# EAGLE schematic GnZC - POC (EAGLE 9.6.2)
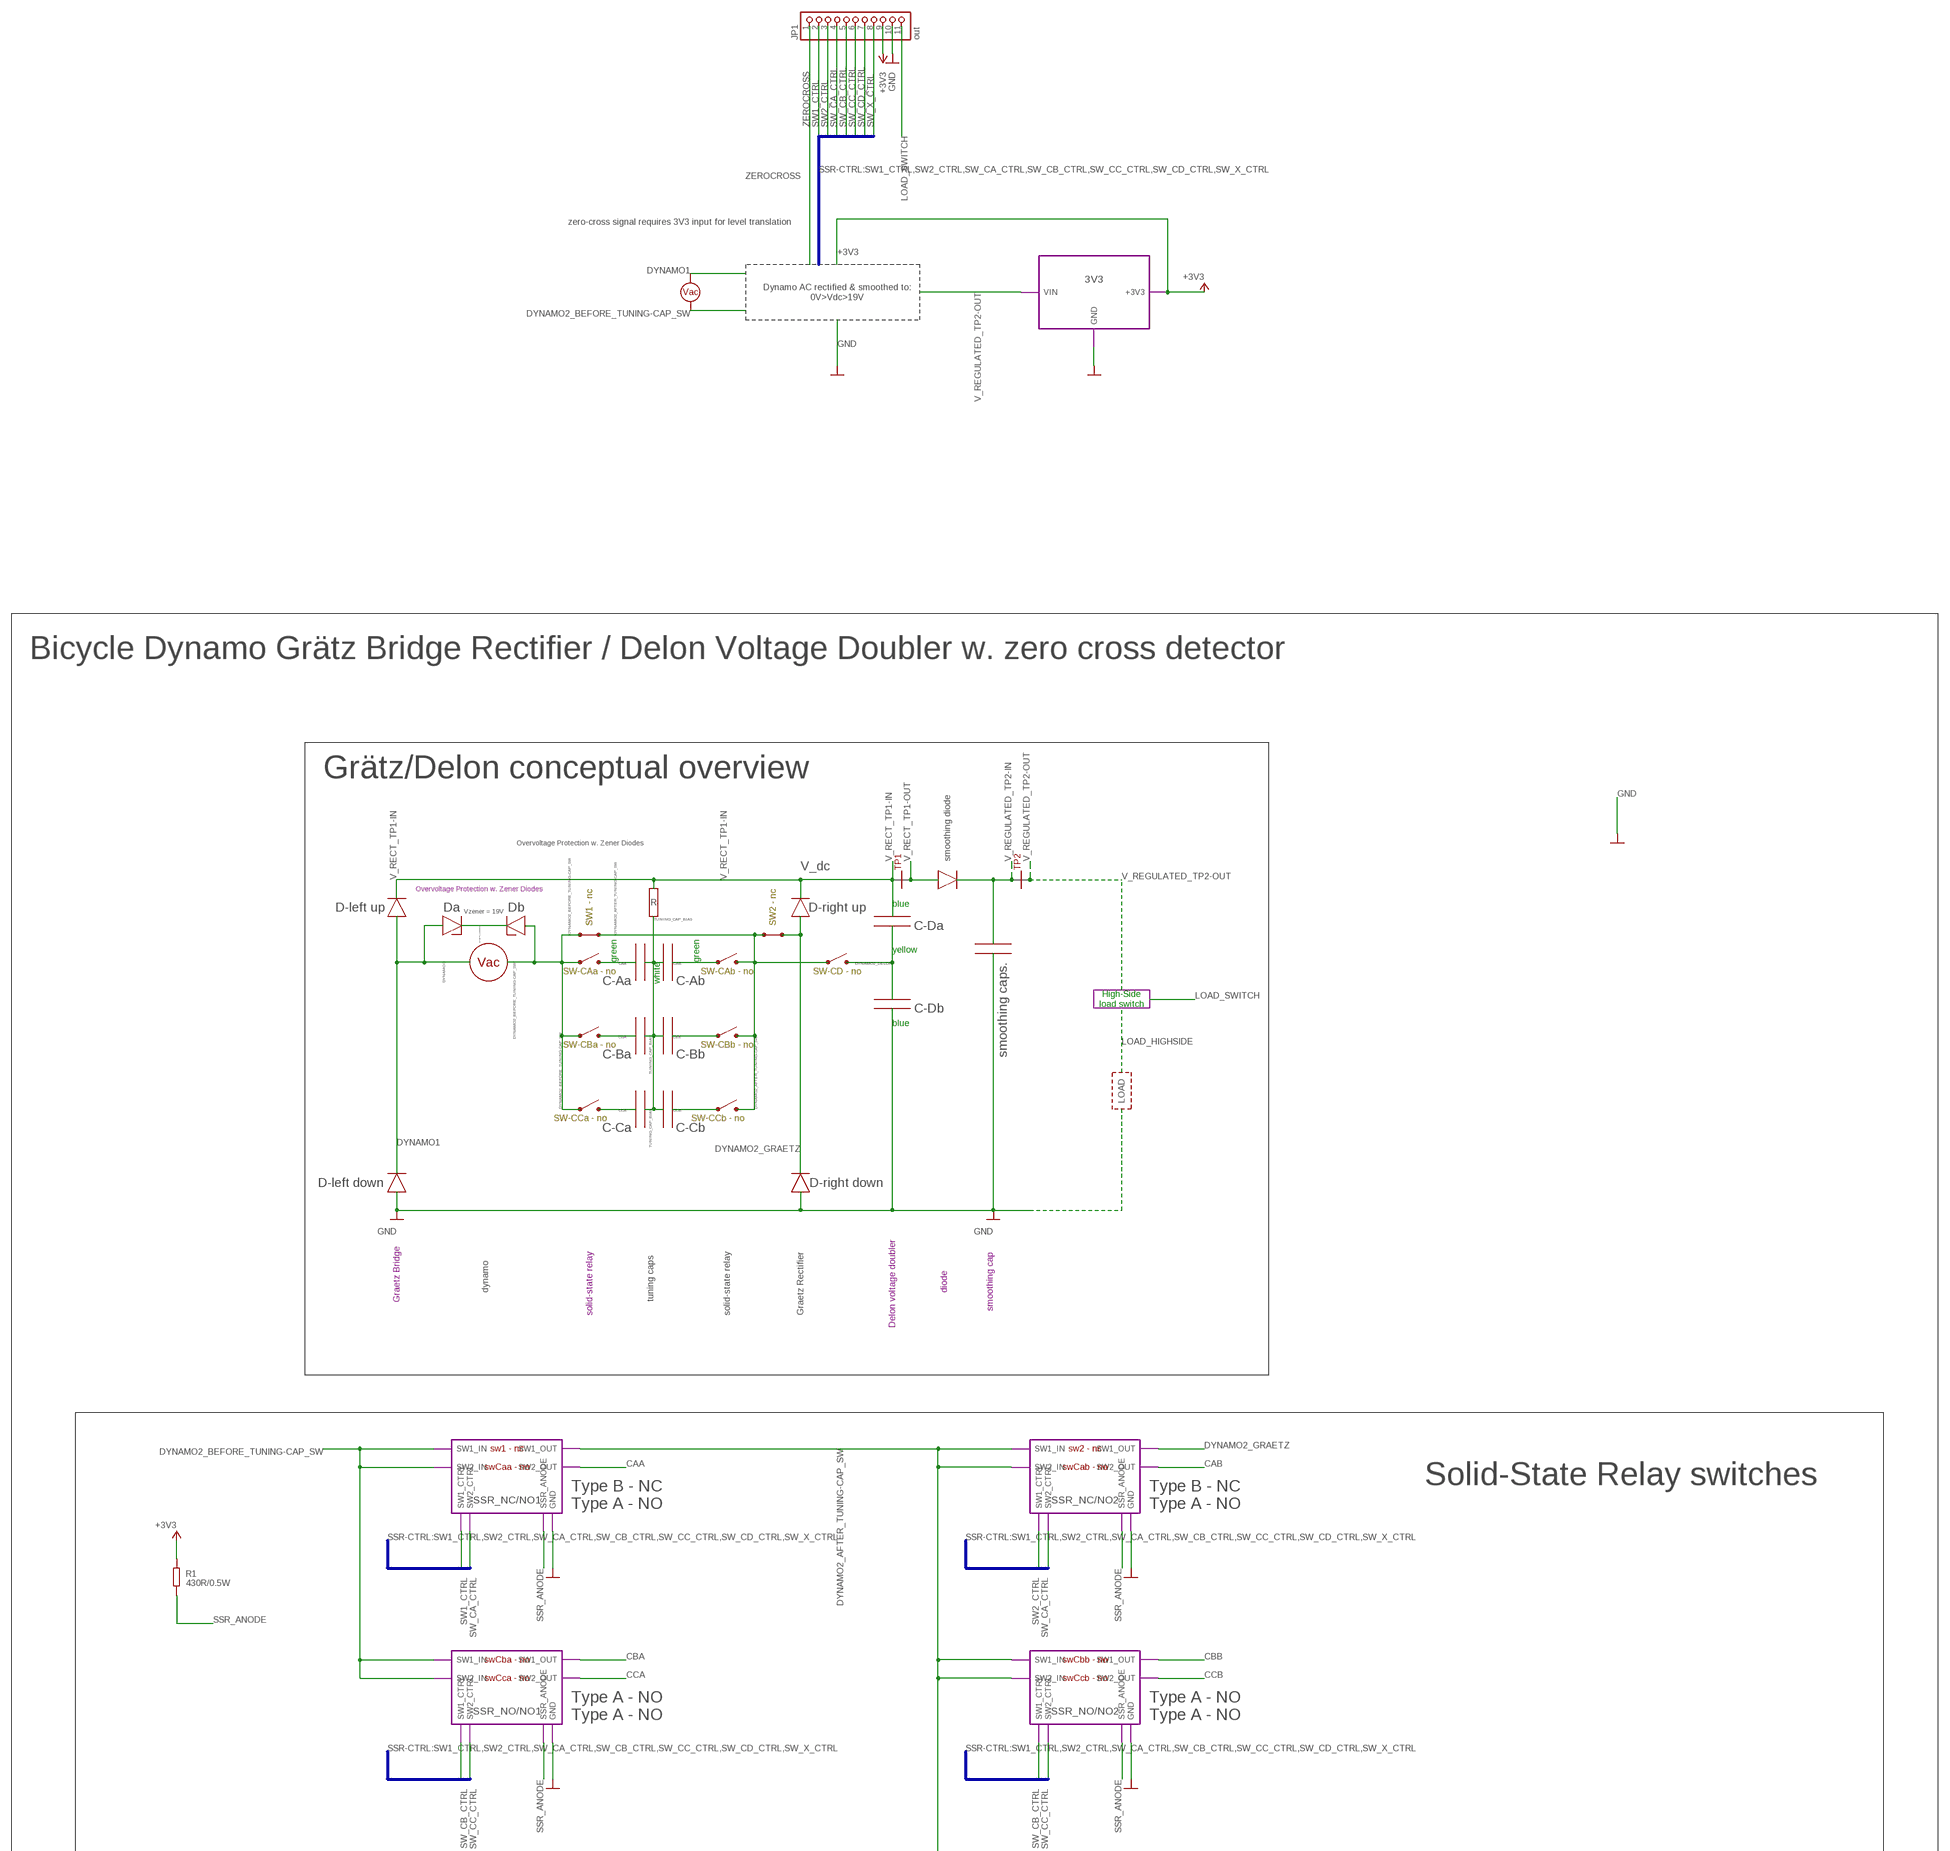
[diagram p0: schematic, sheet 1, part 1 of 3]
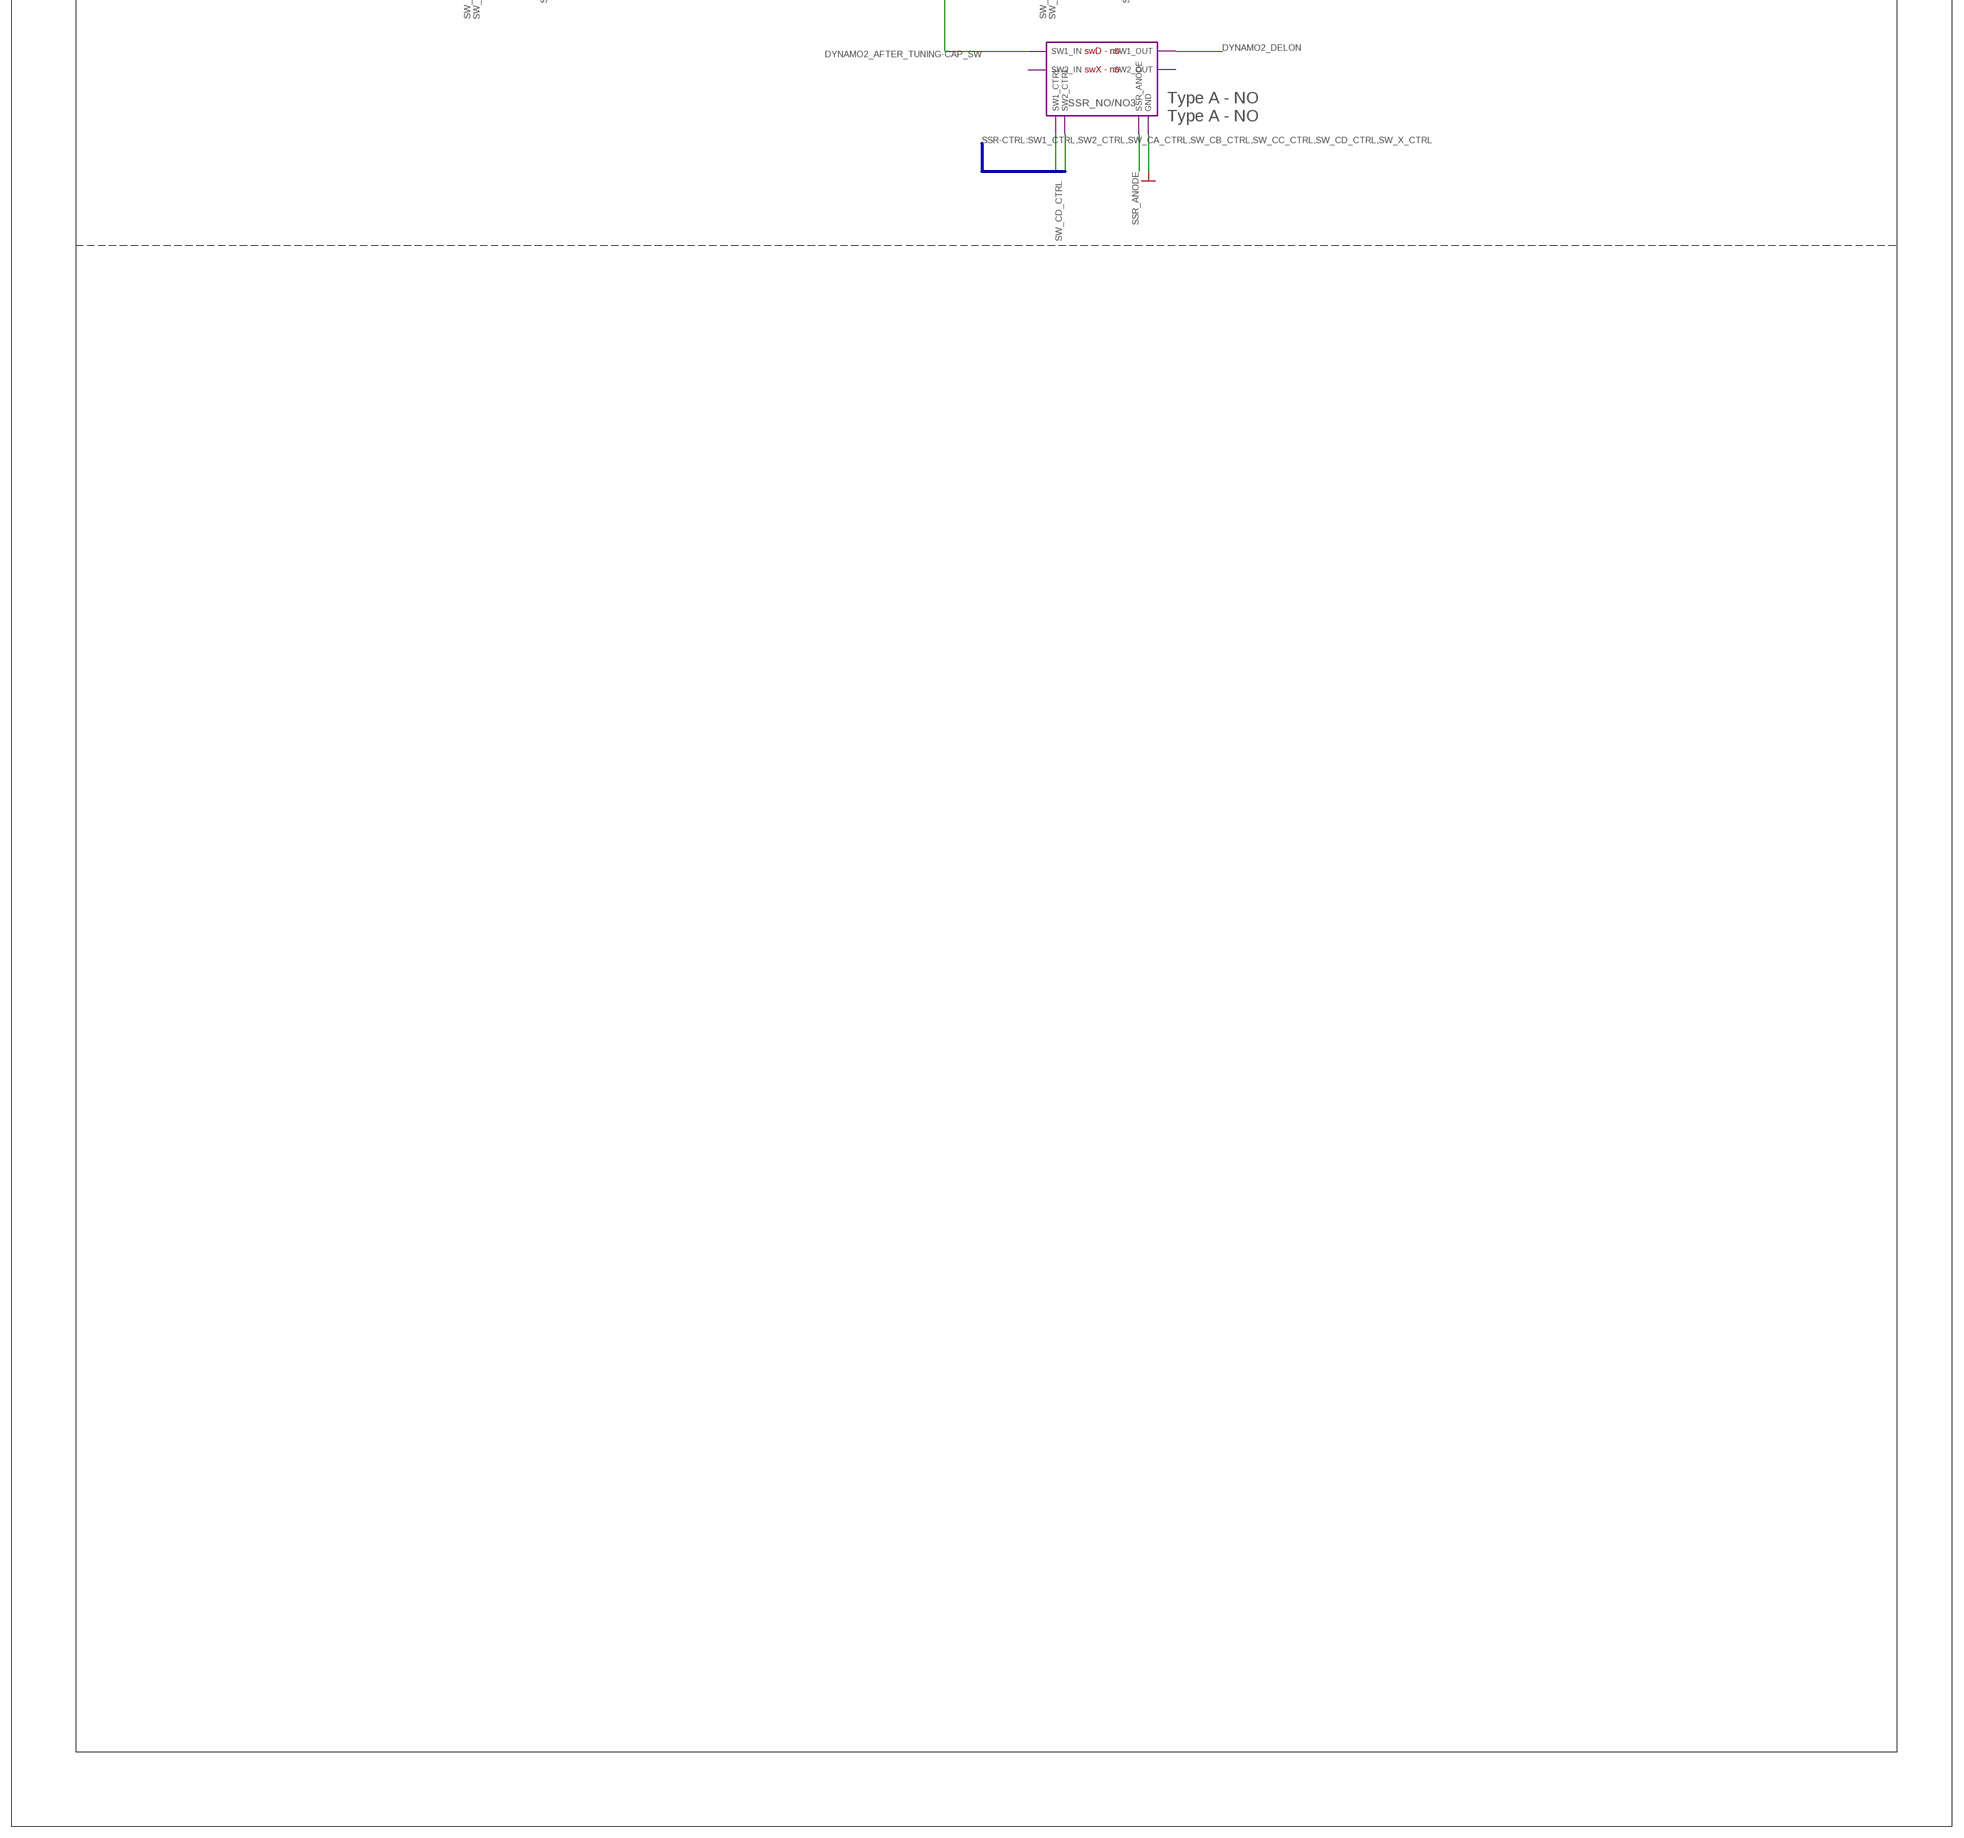
[diagram p1: schematic, sheet 1, part 2 of 3]
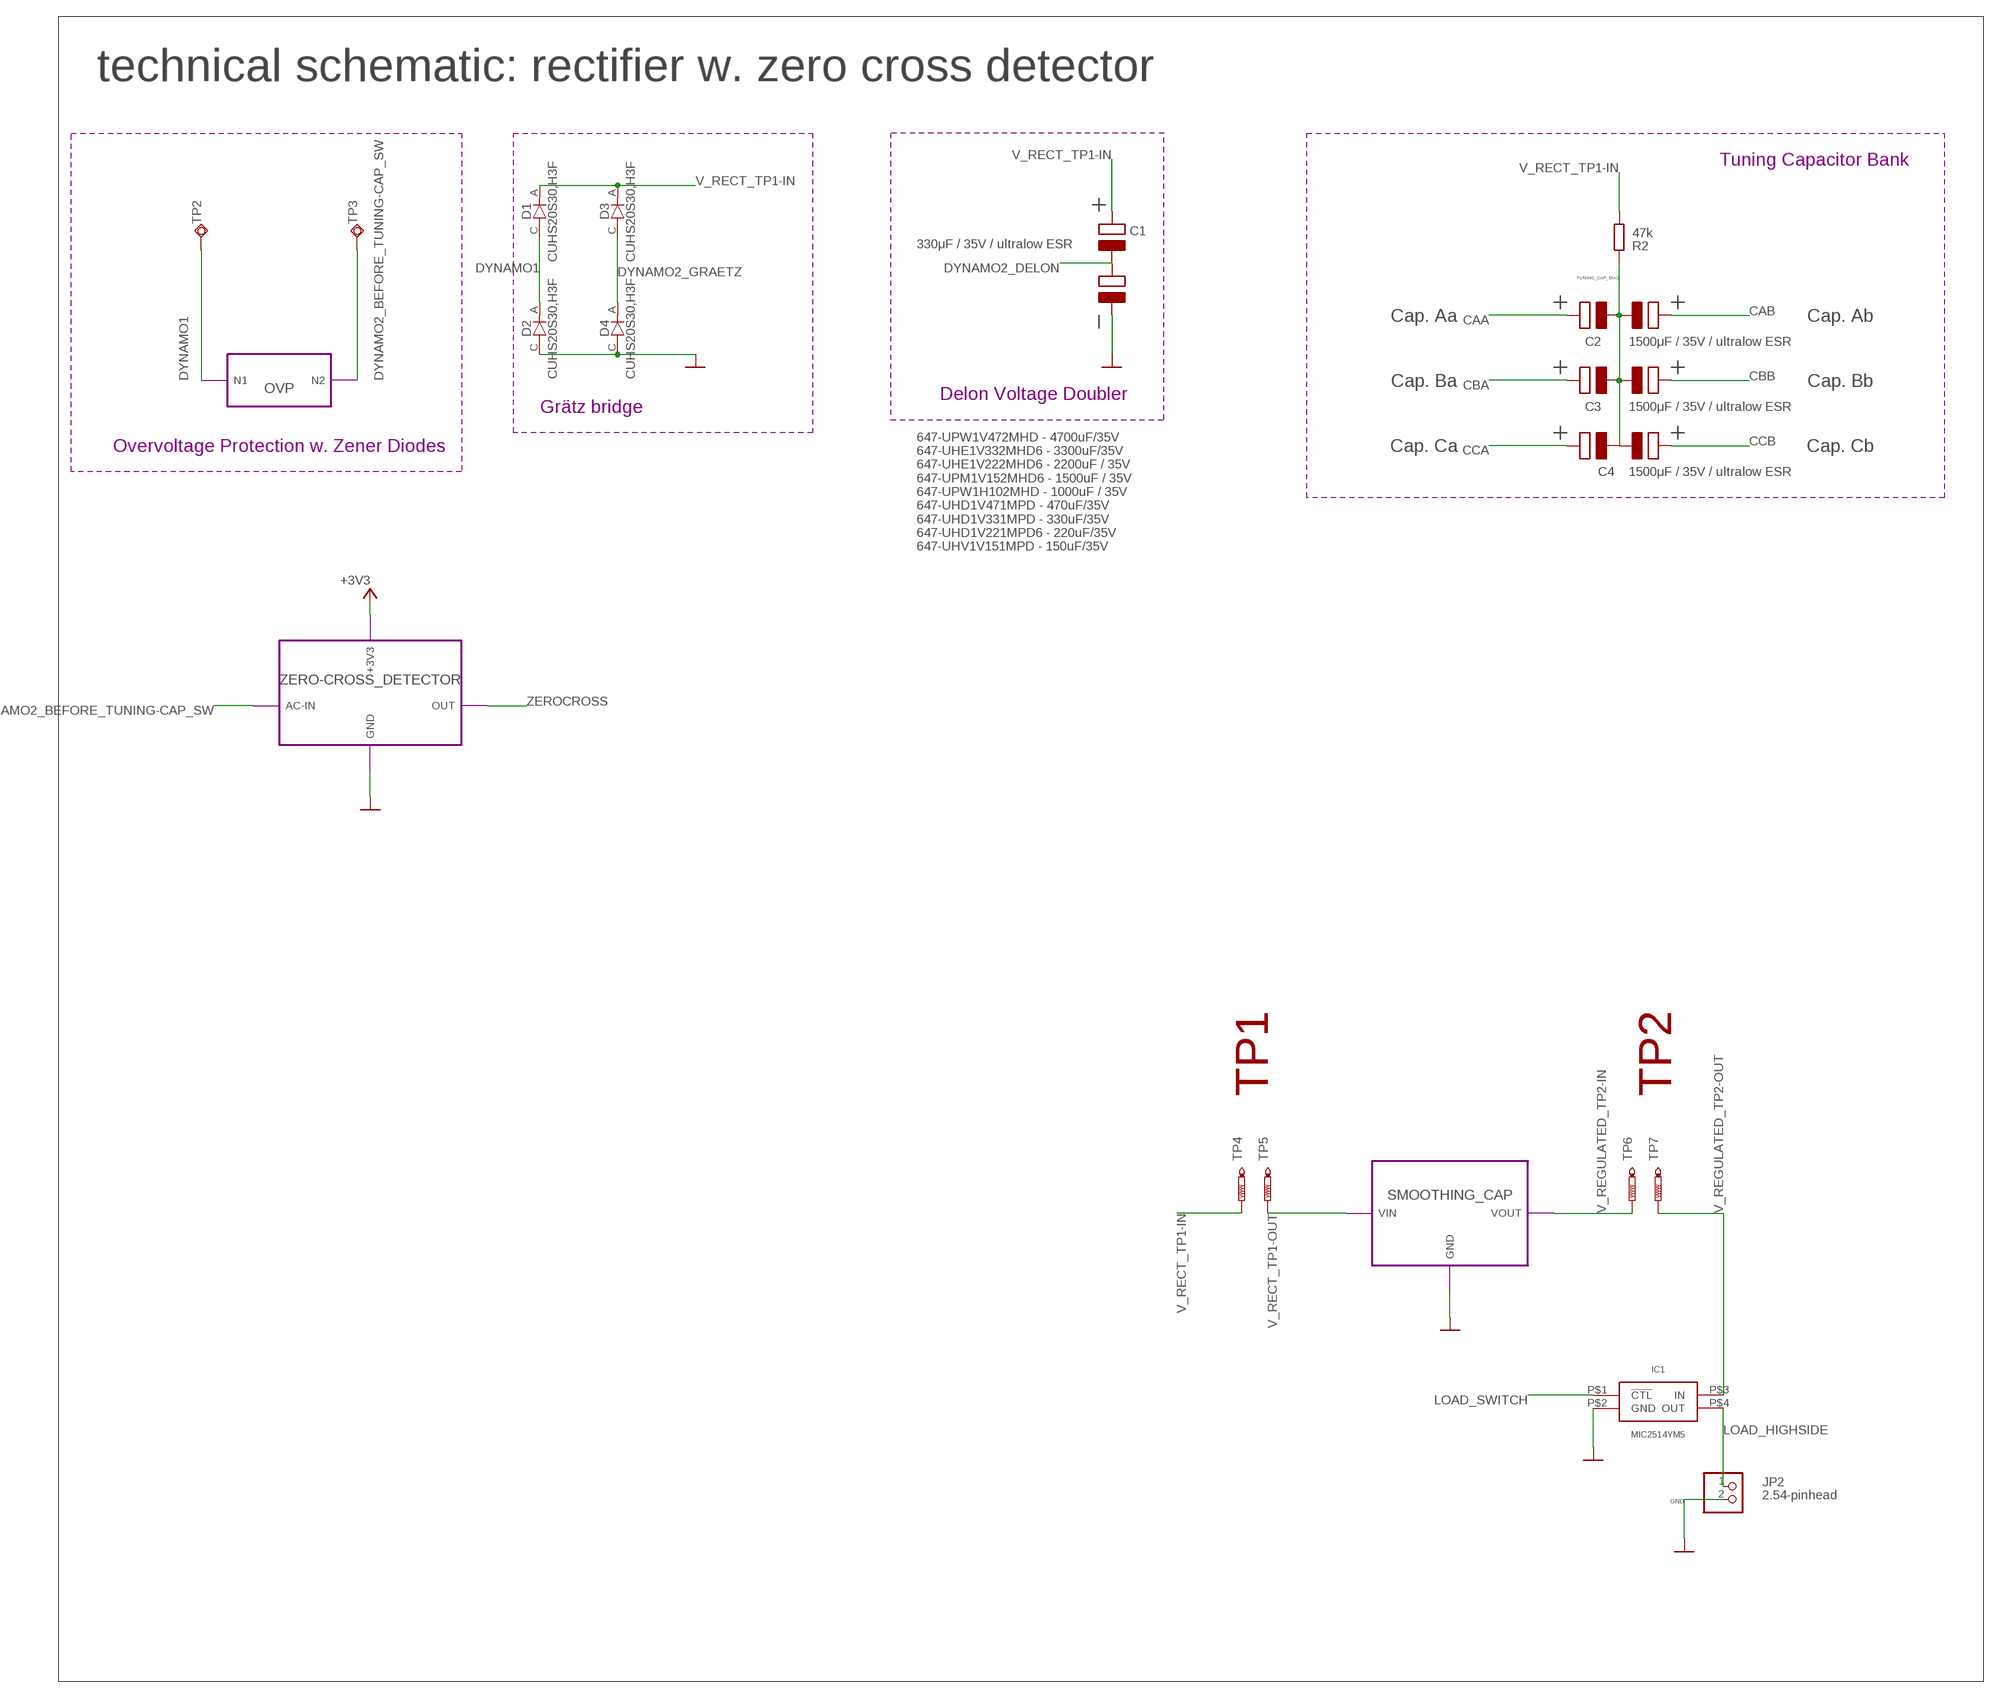
[diagram p2: schematic, sheet 1, part 3 of 3]

## Parts
C1  330μF / 35V / ultralow ESR  C-POL-2S  [TH-2S]
C2  1500μF / 35V / ultralow ESR  C-POL-2S-BACK-TO-BACK  [TH-2S-BACK-TO-BACK]
C3  1500μF / 35V / ultralow ESR  C-POL-2S-BACK-TO-BACK  [TH-2S-BACK-TO-BACK]
C4  1500μF / 35V / ultralow ESR  C-POL-2S-BACK-TO-BACK  [TH-2S-BACK-TO-BACK]
D1  CUHS20S30,H3F  CUHS20S30  [US2H]
D2  CUHS20S30,H3F  CUHS20S30  [US2H]
D3  CUHS20S30,H3F  CUHS20S30  [US2H]
D4  CUHS20S30,H3F  CUHS20S30  [US2H]
IC1  MIC2514YM5  MIC2514  [SOT-23-5]
JP1  out  PINHD-1X11  [1X11]
JP2  2.54-pinhead  PINHD-1X2  [1X02]
R1  430R/0.5W  R-EU_R0805  [R0805]
R2  47k  R-EU_R0805  [R0805]
TP2  dynamo 1  TPSQPAD1-13  [P1-13]
TP3  dynamo 2  TPSQPAD1-13  [P1-13]
TP4  TP1l  PTR1TP10SQ  [TP10SQ]
TP5  TP1r  PTR1TP10SQ  [TP10SQ]
TP6  TP2l  PTR1TP10SQ  [TP10SQ]
TP7  TP2r  PTR1TP10SQ  [TP10SQ]

## Module instances
ZERO-CROSS_DETECTOR = ZERO-CROSS_DETECTOR (part numbers offset by 700)
3V3 = 3V3 (part numbers offset by 900)
SMOOTHING_CAP = SMOOTHING_CAP (part numbers offset by 800)
SSR_NC/NO1 = SSR_NC/NO (part numbers offset by 100)
SSR_NC/NO2 = SSR_NC/NO (part numbers offset by 300)
SSR_NO/NO1 = SSR_NO/NO (part numbers offset by 200)
SSR_NO/NO2 = SSR_NO/NO (part numbers offset by 400)
SSR_NO/NO3 = SSR_NO/NO (part numbers offset by 500)
OVP = OVP (part numbers offset by 600)

## Nets
+3V3 [Vcc]: JP1.9 R1.2 ; port ZERO-CROSS_DETECTOR.+3V3 3V3.+3V3
CAA [DYNAMO_OUT]: C2.1_C ; port SSR_NC/NO1.SW2_OUT
CAB: C2.3_C(2_C) ; port SSR_NC/NO2.SW2_OUT
CBA [DYNAMO_OUT]: C3.1_C ; port SSR_NO/NO1.SW1_OUT
CBB [DYNAMO_OUT]: C3.3_C(2_C) ; port SSR_NO/NO2.SW1_OUT
CCA [DYNAMO_OUT]: C4.1_C ; port SSR_NO/NO1.SW2_OUT
CCB [DYNAMO_OUT]: C4.3_C(2_C) ; port SSR_NO/NO2.SW2_OUT
DYNAMO1 [DYNAMO_OUT]: D1.C D2.A TP2.TP ; port OVP.N1
DYNAMO2_AFTER_TUNING-CAP_SW [DYNAMO_OUT]: port SSR_NC/NO1.SW1_OUT SSR_NC/NO2.SW1_IN SSR_NC/NO2.SW2_IN SSR_NO/NO2.SW1_IN SSR_NO/NO2.SW2_IN SSR_NO/NO3.SW1_IN
DYNAMO2_BEFORE_TUNING-CAP_SW [DYNAMO_OUT]: TP3.TP ; port SSR_NC/NO1.SW1_IN SSR_NC/NO1.SW2_IN SSR_NO/NO1.SW1_IN SSR_NO/NO1.SW2_IN OVP.N2 ZERO-CROSS_DETECTOR.AC-IN
DYNAMO2_DELON [DYNAMO_OUT]: C1.2_MID(MID) ; port SSR_NO/NO3.SW1_OUT
DYNAMO2_GRAETZ [DYNAMO_OUT]: D3.C D4.A ; port SSR_NC/NO2.SW1_OUT
GND: C1.3_NEG(NEG) D2.C D4.C IC1.P$2(GND) JP1.10 JP2.2 ; port 3V3.GND SMOOTHING_CAP.GND ZERO-CROSS_DETECTOR.GND SSR_NC/NO1.GND SSR_NC/NO2.GND SSR_NO/NO1.GND SSR_NO/NO2.GND SSR_NO/NO3.GND
LOAD_HIGHSIDE: IC1.P$4(OUT) JP2.1
LOAD_SWITCH [signal]: IC1.P$1(!CTL!) JP1.11
SSR_ANODE [V_DC]: R1.1 ; port SSR_NC/NO1.SSR_ANODE SSR_NC/NO2.SSR_ANODE SSR_NO/NO1.SSR_ANODE SSR_NO/NO2.SSR_ANODE SSR_NO/NO3.SSR_ANODE
SW1_CTRL [signal]: JP1.2 ; port SSR_NC/NO1.SW1_CTRL
SW2_CTRL [signal]: JP1.3 ; port SSR_NC/NO2.SW1_CTRL
SW_CA_CTRL [signal]: JP1.4 ; port SSR_NC/NO2.SW2_CTRL SSR_NC/NO1.SW2_CTRL
SW_CB_CTRL [signal]: JP1.5 ; port SSR_NO/NO2.SW1_CTRL SSR_NO/NO1.SW1_CTRL
SW_CC_CTRL [signal]: JP1.6 ; port SSR_NO/NO2.SW2_CTRL SSR_NO/NO1.SW2_CTRL
SW_CD_CTRL [signal]: JP1.7 ; port SSR_NO/NO3.SW1_CTRL
SW_X_CTRL [signal]: JP1.8 ; port SSR_NO/NO3.SW2_CTRL
TUNING_CAP_BIAS [DYNAMO_OUT]: C2.2_MID(MID) C3.2_MID(MID) C4.2_MID(MID) R2.1
V_RECT_TP1-IN [V_REGULATED]: C1.1_POS(POS) D1.A D3.A R2.2 TP4.TP
V_RECT_TP1-OUT [V_REGULATED]: TP5.TP ; port SMOOTHING_CAP.VIN
V_REGULATED_TP2-IN [Vcc]: TP6.TP ; port SMOOTHING_CAP.VOUT
V_REGULATED_TP2-OUT [Vcc]: IC1.P$3(IN) TP7.TP ; port 3V3.VIN
ZEROCROSS [signal]: JP1.1 ; port ZERO-CROSS_DETECTOR.OUT

## Buses
SSR-CTRL:SW1_CTRL,SW2_CTRL,SW_CA_CTRL,SW_CB_CTRL,SW_CC_CTRL,SW_CD_CTRL,SW_X_CTRL

## Notes on the sheet
- zero-cross signal requires 3V3 input for level translation
- Vac
- Dynamo AC rectified & smoothed to:
  0V>Vdc>19V
- Bicycle Dynamo Grätz Bridge Rectifier / Delon Voltage Doubler w. zero cross detector
- Grätz/Delon conceptual overview
- Overvoltage Protection w. Zener Diodes
- smoothing diode
- V_dc | TP1 | TP2
- Overvoltage Protection w. Zener Diodes
- R
- D-left up | Da | Db | SW1 - nc | SW2 - nc | D-right up | blue
- Vzener = 19V
- C-Da
- yellow
- Vac | green | white | green | smoothing caps.
- SW-CAa - no | SW-CAb - no | SW-CD - no
- C-Aa | C-Ab
- High-Side
  load switch
- C-Db
- blue
- SW-CBa - no | SW-CBb - no
- C-Ba | C-Bb
- LOAD
- SW-CCa - no | SW-CCb - no
- C-Ca | C-Cb
- D-left down | D-right down
- Graetz Bridge
- solid-state relay | solid-state relay | Graetz Rectifier | Delon voltage doubler
- dynamo | diode
- tuning caps
- smoothing cap
- sw1 - nc | sw2 - nc
- swCaa - no | swCab - no
- Solid-State Relay switches
- Type B - NC
  Type A - NO
- Type B - NC
  Type A - NO
- swCba - no | swCbb - no
- swCca - no | swCcb - no | technical schematic: rectifier w. zero cross detector
- Type A - NO
  Type A - NO
- Type A - NO
  Type A - NO
- Tuning Capacitor Bank
- Cap. Aa | Cap. Ab
- swD - no
- Cap. Ba | Cap. Bb
- swX - no | Delon Voltage Doubler
- Grätz bridge
- 647-UPW1V472MHD - 4700uF/35V
  647-UHE1V332MHD6 - 3300uF/35V
  647-UHE1V222MHD6 - 2200uF / 35V
  647-UPM1V152MHD6 - 1500uF / 35V
  647-UPW1H102MHD - 1000uF / 35V
  647-UHD1V471MPD - 470uF/35V
  647-UHD1V331MPD - 330uF/35V
  647-UHD1V221MPD6 - 220uF/35V
  647-UHV1V151MPD - 150uF/35V
- Type A - NO
  Type A - NO
- Overvoltage Protection w. Zener Diodes | Cap. Ca | Cap. Cb
- TP1 | TP2

## Library data of the parts
C1 = C-Pol:C-POL-2S
C2-C4 = C-Pol:C-POL-2S-BACK-TO-BACK
D1-D4 = CUHS20S30 - Schottky Barrier Diode:CUHS20S30
IC1 = MIC2514 - High-Side load switch:MIC2514
JP1 = pinhead:PINHD-1X11: PIN HEADER
JP2 = pinhead:PINHD-1X2: PIN HEADER
R1 R2 = rcl:R-EU_: RESISTOR, European symbol; SPICEPREFIX: R
TP2 TP3 = testpad:TPSQ: Test pad
TP4-TP7 = testpad:PTR1: TEST PIN

## Module ZERO-CROSS_DETECTOR
Ports: GND(pwr) +3V3(pwr) AC-IN(in) OUT(out)
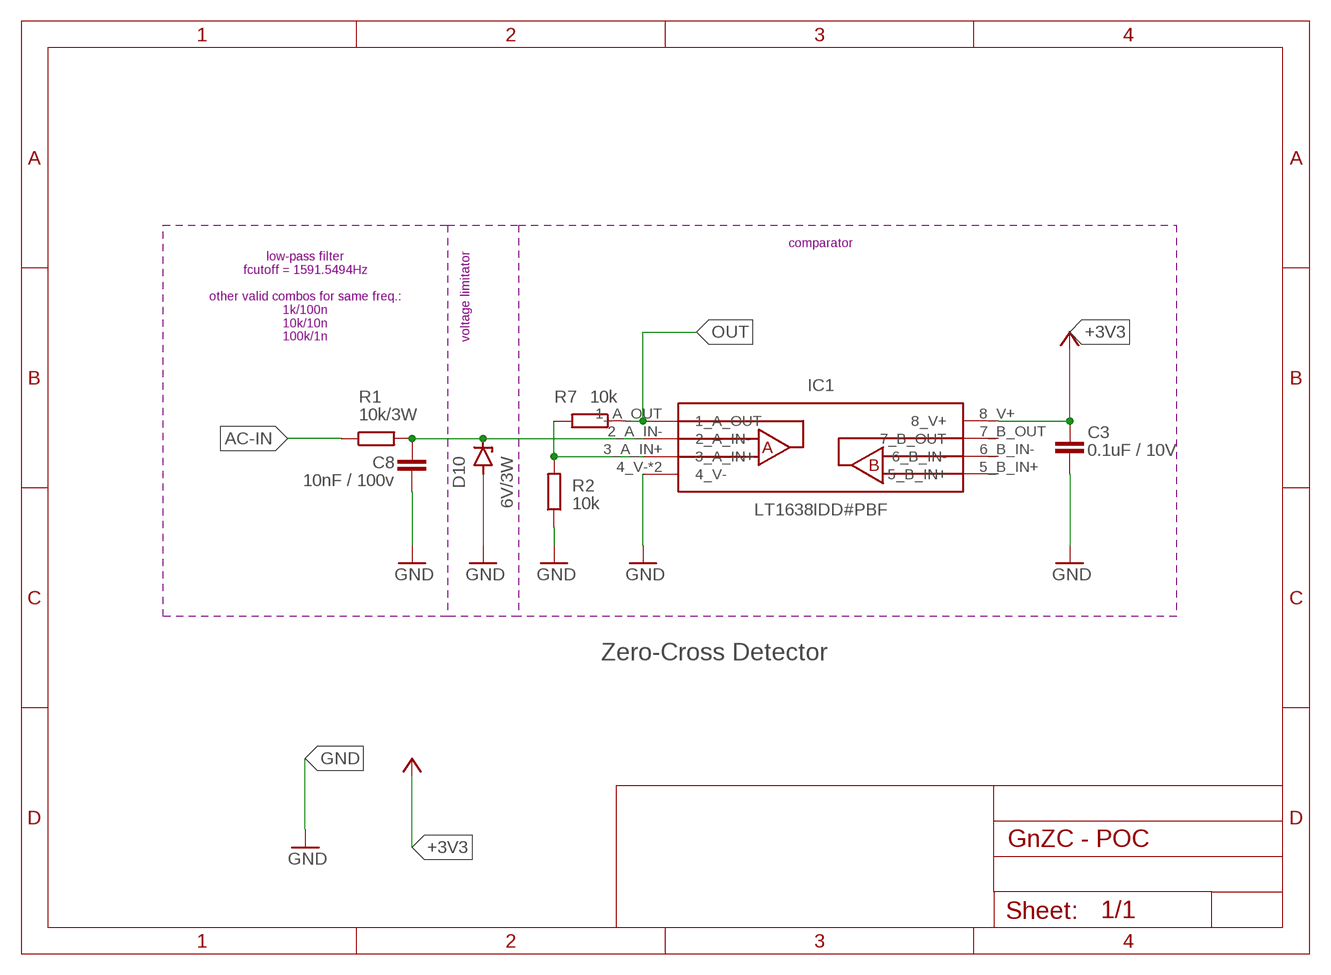
[diagram p3: schematic, module ZERO-CROSS_DETECTOR, sheet 1]

### Parts
C3  0.1uF / 10V  C-EUC0805  [C0805]
C8  10nF / 100v  C-EUC1812  [C1812]
D10  6V/3W  ZENER-DIODEDO214AA  [DO214AA]
IC1  LT1638IDD#PBF  LT1638  [DFN-8]
R1  10k/3W  R-EU_R2512  [R2512]
R2  10k  R-EU_R0805  [R0805]
R7  10k  R-EU_R0805  [R0805]

### Nets
+3V3 [Vcc]: C3.2 IC1.8_V+
AC-IN [DYNAMO_OUT]: R1.1
GND: C3.1 C8.1 D10.A IC1.4_V- IC1.9_V-(4_V-) R2.1
N$6 [Vcc]: C8.2 D10.C IC1.2_A_IN- R1.2
N$12: IC1.3_A_IN+ R2.2 R7.2
OUT [signal]: IC1.1_A_OUT R7.1
Unconnected: IC1.5_B_IN+ IC1.6_B_IN- IC1.7_B_OUT

### Notes on the sheet
- comparator
- low-pass filter
  fcutoff = 1591.5494Hz
  
  other valid combos for same freq.:
  1k/100n
  10k/10n
  100k/1n
- voltage limitator
- Zero-Cross Detector

### Library data of the parts
C3 C8 = rcl:C-EU: CAPACITOR, European symbol; SPICEPREFIX: C
D10 = diode:ZENER-DIODE: Z-Diode
IC1 = LT1638 - Rail to Rail OpAmp:LT1638
R1 R2 R7 = rcl:R-EU_: RESISTOR, European symbol; SPICEPREFIX: R

## Module 3V3
Ports: GND(pwr) +3V3(pwr) VIN(pwr)
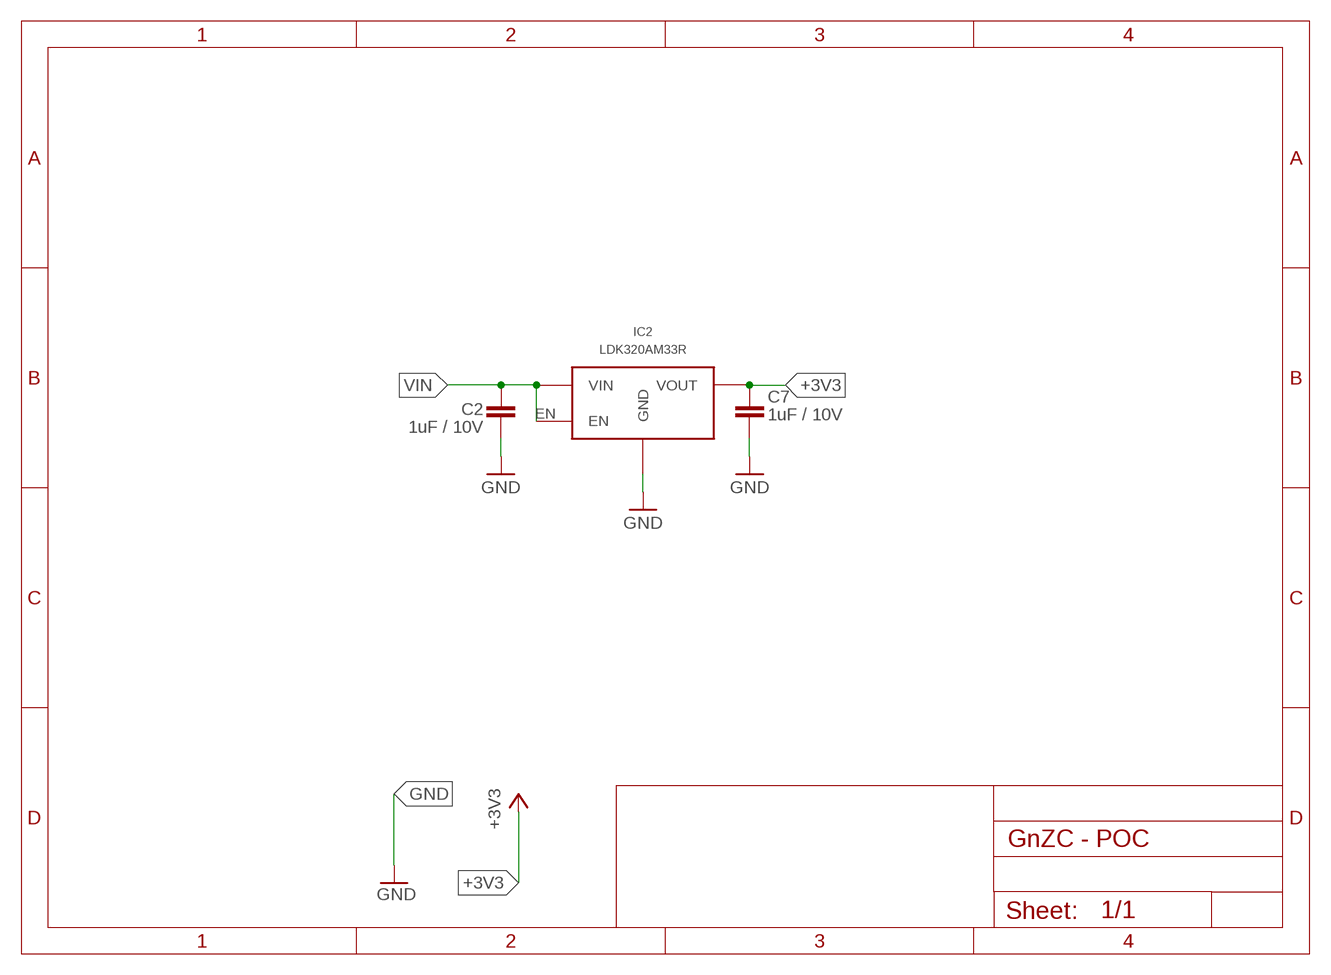
[diagram p4: schematic, module 3V3, sheet 1]

### Parts
C2  1uF / 10V  C-EUC0805  [C0805]
C7  1uF / 10V  C-EUC0805  [C0805]
IC2  LDK320AM33R  LDK320SOT-23-5L  [SOT-23-5L]

### Nets
+3V3 [Vcc]: C7.2 IC2.OUT(VOUT)
GND: C2.2 C7.1 IC2.GND
VIN [DYNAMO_OUT]: C2.1 IC2.EN IC2.IN(VIN)

### Library data of the parts
C2 C7 = rcl:C-EU: CAPACITOR, European symbol; SPICEPREFIX: C
IC2 = LDK320 5V LDO:LDK320

## Module SMOOTHING_CAP
Ports: GND(io) VIN(pwr) VOUT(pwr)
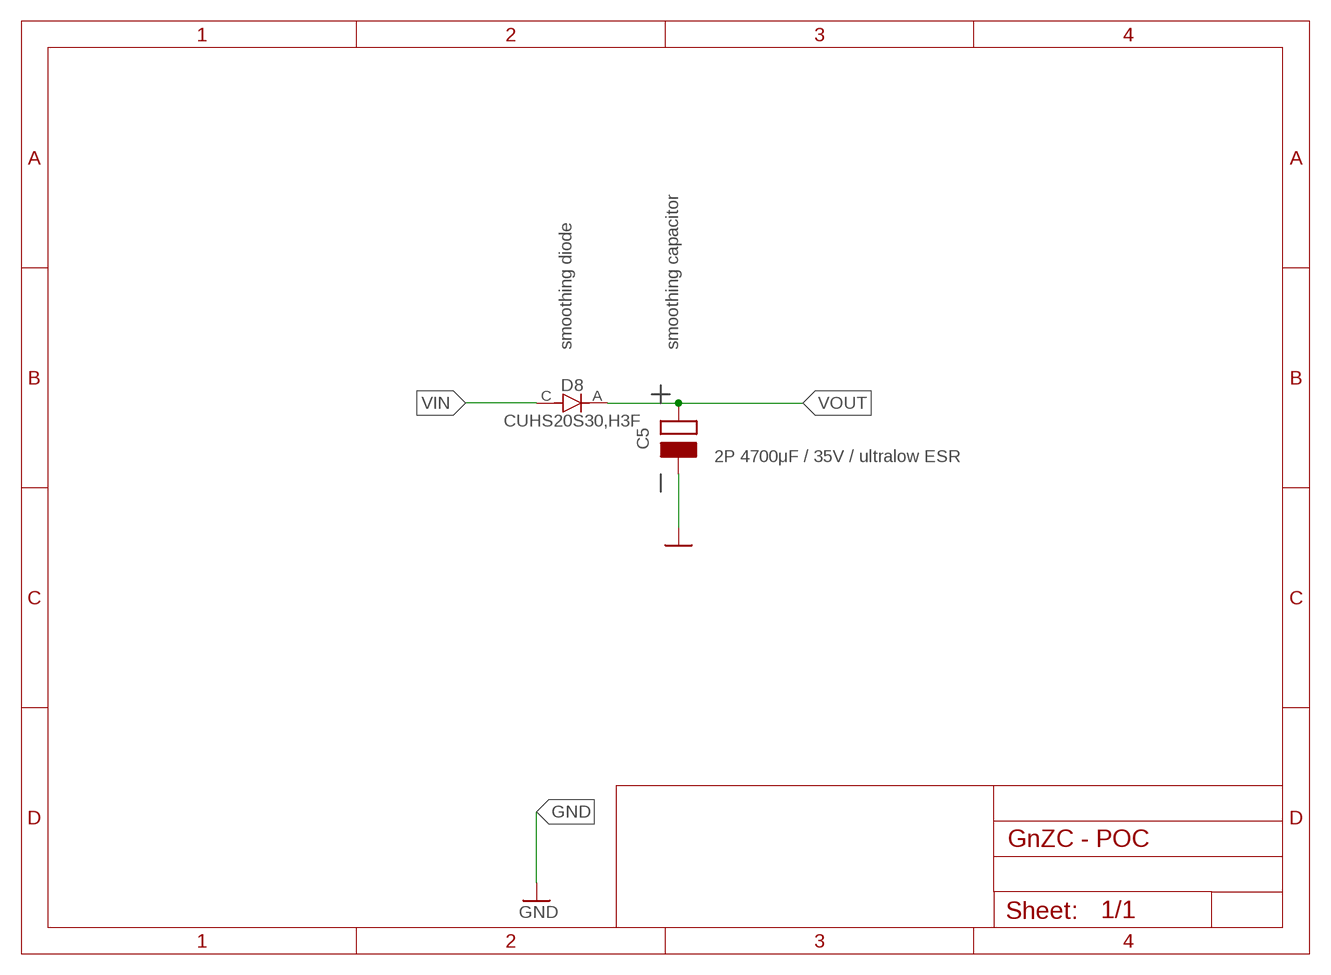
[diagram p5: schematic, module SMOOTHING_CAP, sheet 1]

### Parts
C5  2P 4700μF / 35V / ultralow ESR  C-POL  [TH]
D8  CUHS20S30,H3F  CUHS20S30  [US2H]

### Nets
GND: C5.NEG
VIN [V_REGULATED]: D8.C
VOUT [Vcc]: C5.POS D8.A

### Notes on the sheet
- smoothing diode | smoothing capacitor

### Library data of the parts
C5 = C-Pol:C-POL
D8 = CUHS20S30 - Schottky Barrier Diode:CUHS20S30

## Module SSR_NC/NO
Ports: SSR_ANODE(pwr) GND(pwr) SW2_CTRL(in) SW1_CTRL(in) SW1_IN(hiz) SW2_IN(hiz) SW1_OUT(hiz) SW2_OUT(hiz)
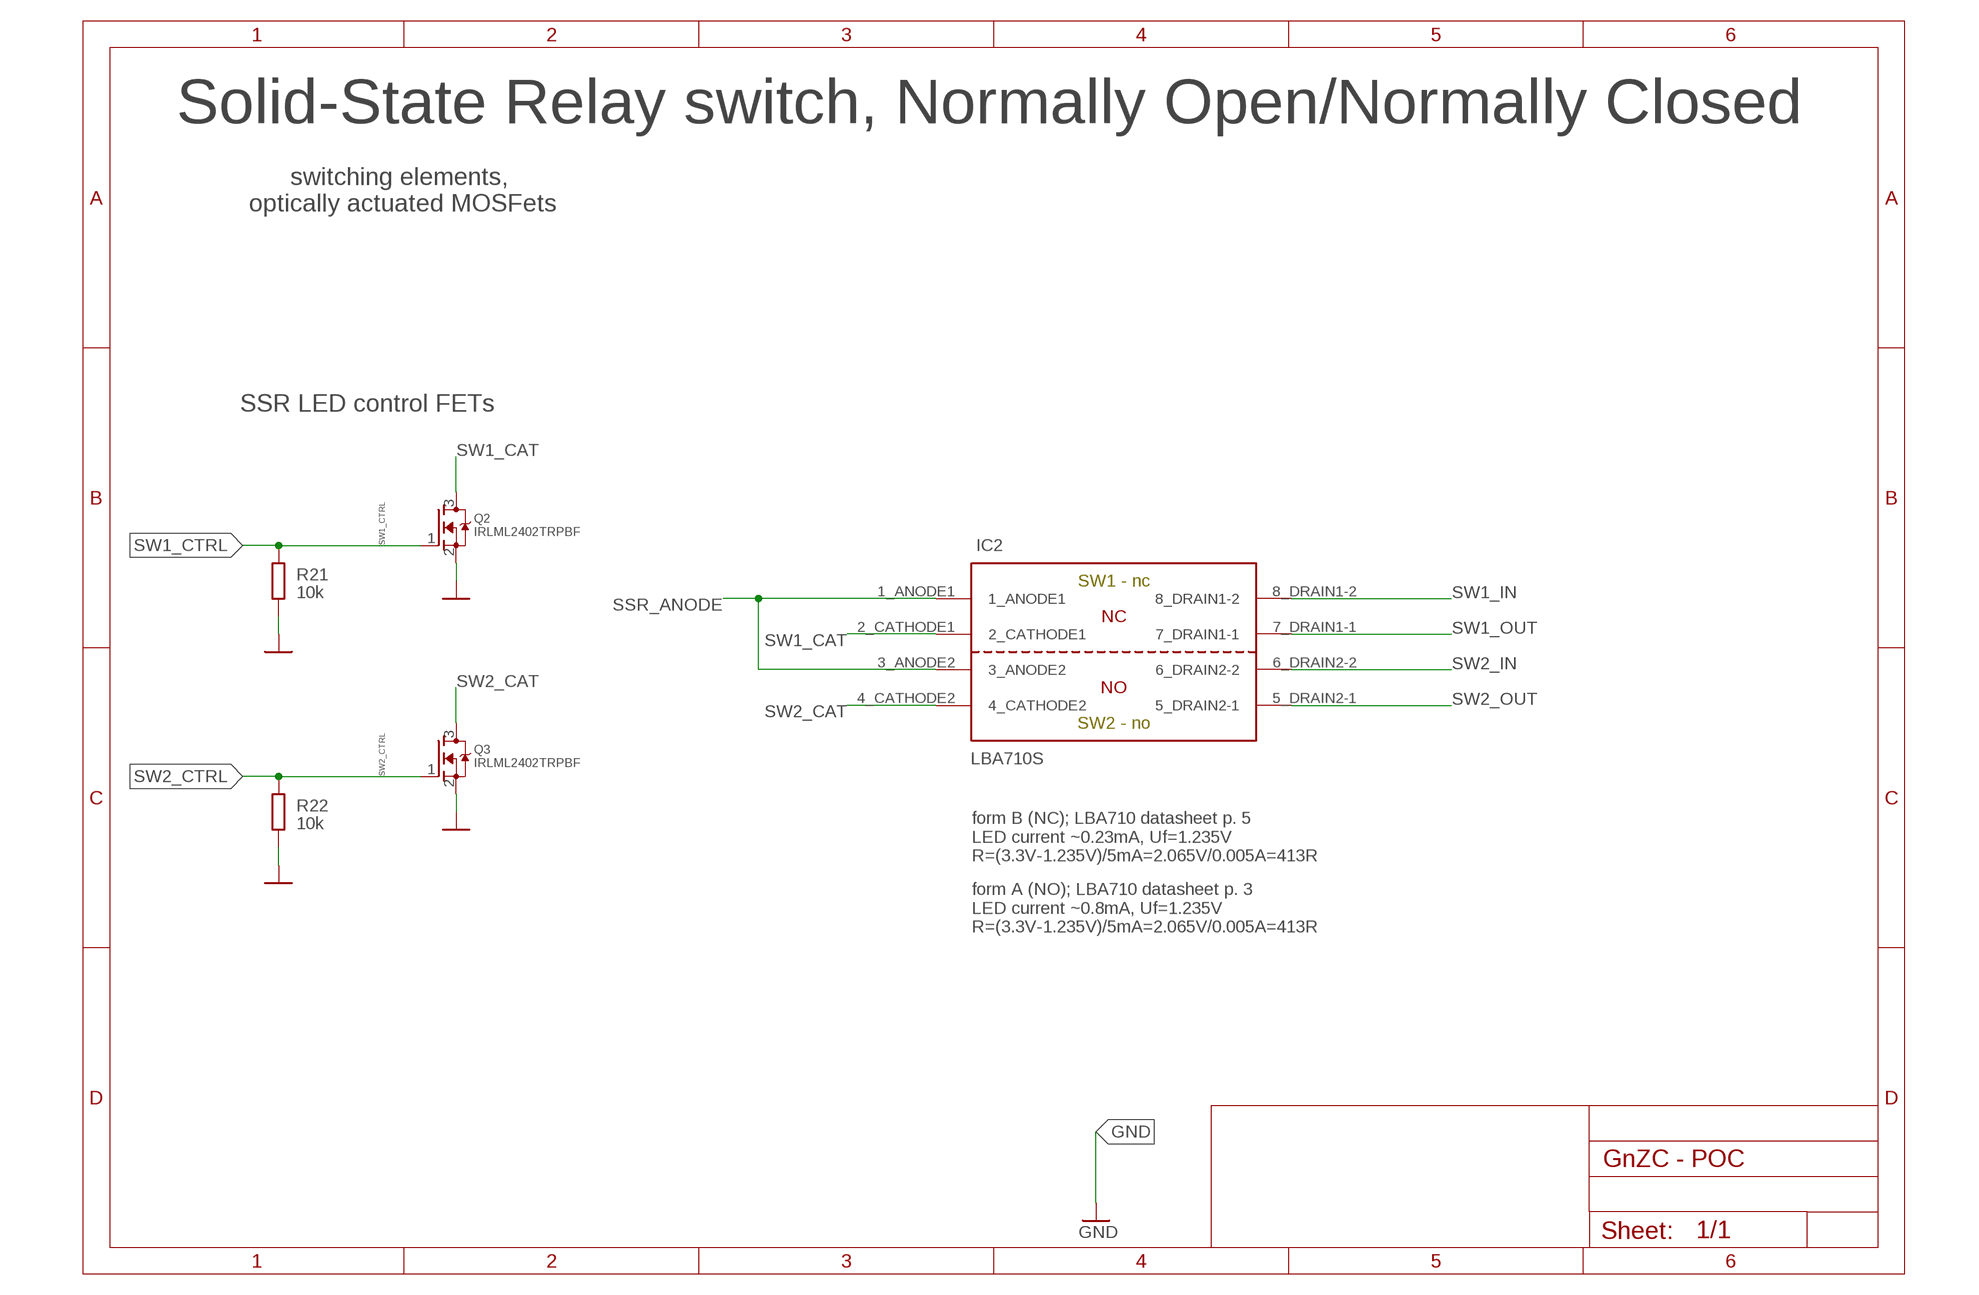
[diagram p6: schematic, module SSR_NC/NO, sheet 1]

### Parts
IC2  LBA710S  LBA710  [SMD_DIP8]
Q2  IRLML2402TRPBF  MOSFET-NREFLOW  [SOT23]
Q3  IRLML2402TRPBF  MOSFET-NREFLOW  [SOT23]
R21  10k  R-EU_R0805  [R0805]
R22  10k  R-EU_R0805  [R0805]

### Nets
GND: Q2.2(S) Q3.2(S) R21.2 R22.2
SSR_ANODE: IC2.1_ANODE1 IC2.3_ANODE2
SW1_CAT [signal]: IC2.2_CATHODE1 Q2.3(D)
SW1_CTRL [signal]: Q2.1(G) R21.1
SW1_IN [DYNAMO_OUT]: IC2.8_DRAIN1-2
SW1_OUT [DYNAMO_OUT]: IC2.7_DRAIN1-1
SW2_CAT [signal]: IC2.4_CATHODE2 Q3.3(D)
SW2_CTRL [signal]: Q3.1(G) R22.1
SW2_IN [DYNAMO_OUT]: IC2.6_DRAIN2-2
SW2_OUT [DYNAMO_OUT]: IC2.5_DRAIN2-1

### Notes on the sheet
- Solid-State Relay switch, Normally Open/Normally Closed
- switching elements, 
  optically actuated MOSFets
- SSR LED control FETs
- SW1 - nc
- SW2 - no
- form B (NC); LBA710 datasheet p. 5
  LED current ~0.23mA, Uf=1.235V
  R=(3.3V-1.235V)/5mA=2.065V/0.005A=413R
- form A (NO); LBA710 datasheet p. 3
  LED current ~0.8mA, Uf=1.235V
  R=(3.3V-1.235V)/5mA=2.065V/0.005A=413R

### Library data of the parts
IC2 = LxA710 - Solid State Relay Form A-AB:LBA710
Q2 Q3 = adafruit:MOSFET-N: N-Channel Mosfet 2N7002E - 60V 260mA SOT23 [Digikey: 2N7002ET1GOSTR-ND] - REEL BSH103 - 30V 850mA SOT23 [Digikey: 568-5013-1-ND]
R21 R22 = rcl:R-EU_: RESISTOR, European symbol; SPICEPREFIX: R

## Module SSR_NO/NO
Ports: GND(pwr) SSR_ANODE(pwr) SW2_CTRL(in) SW1_CTRL(in) SW1_IN(hiz) SW1_OUT(hiz) SW2_IN(hiz) SW2_OUT(hiz)
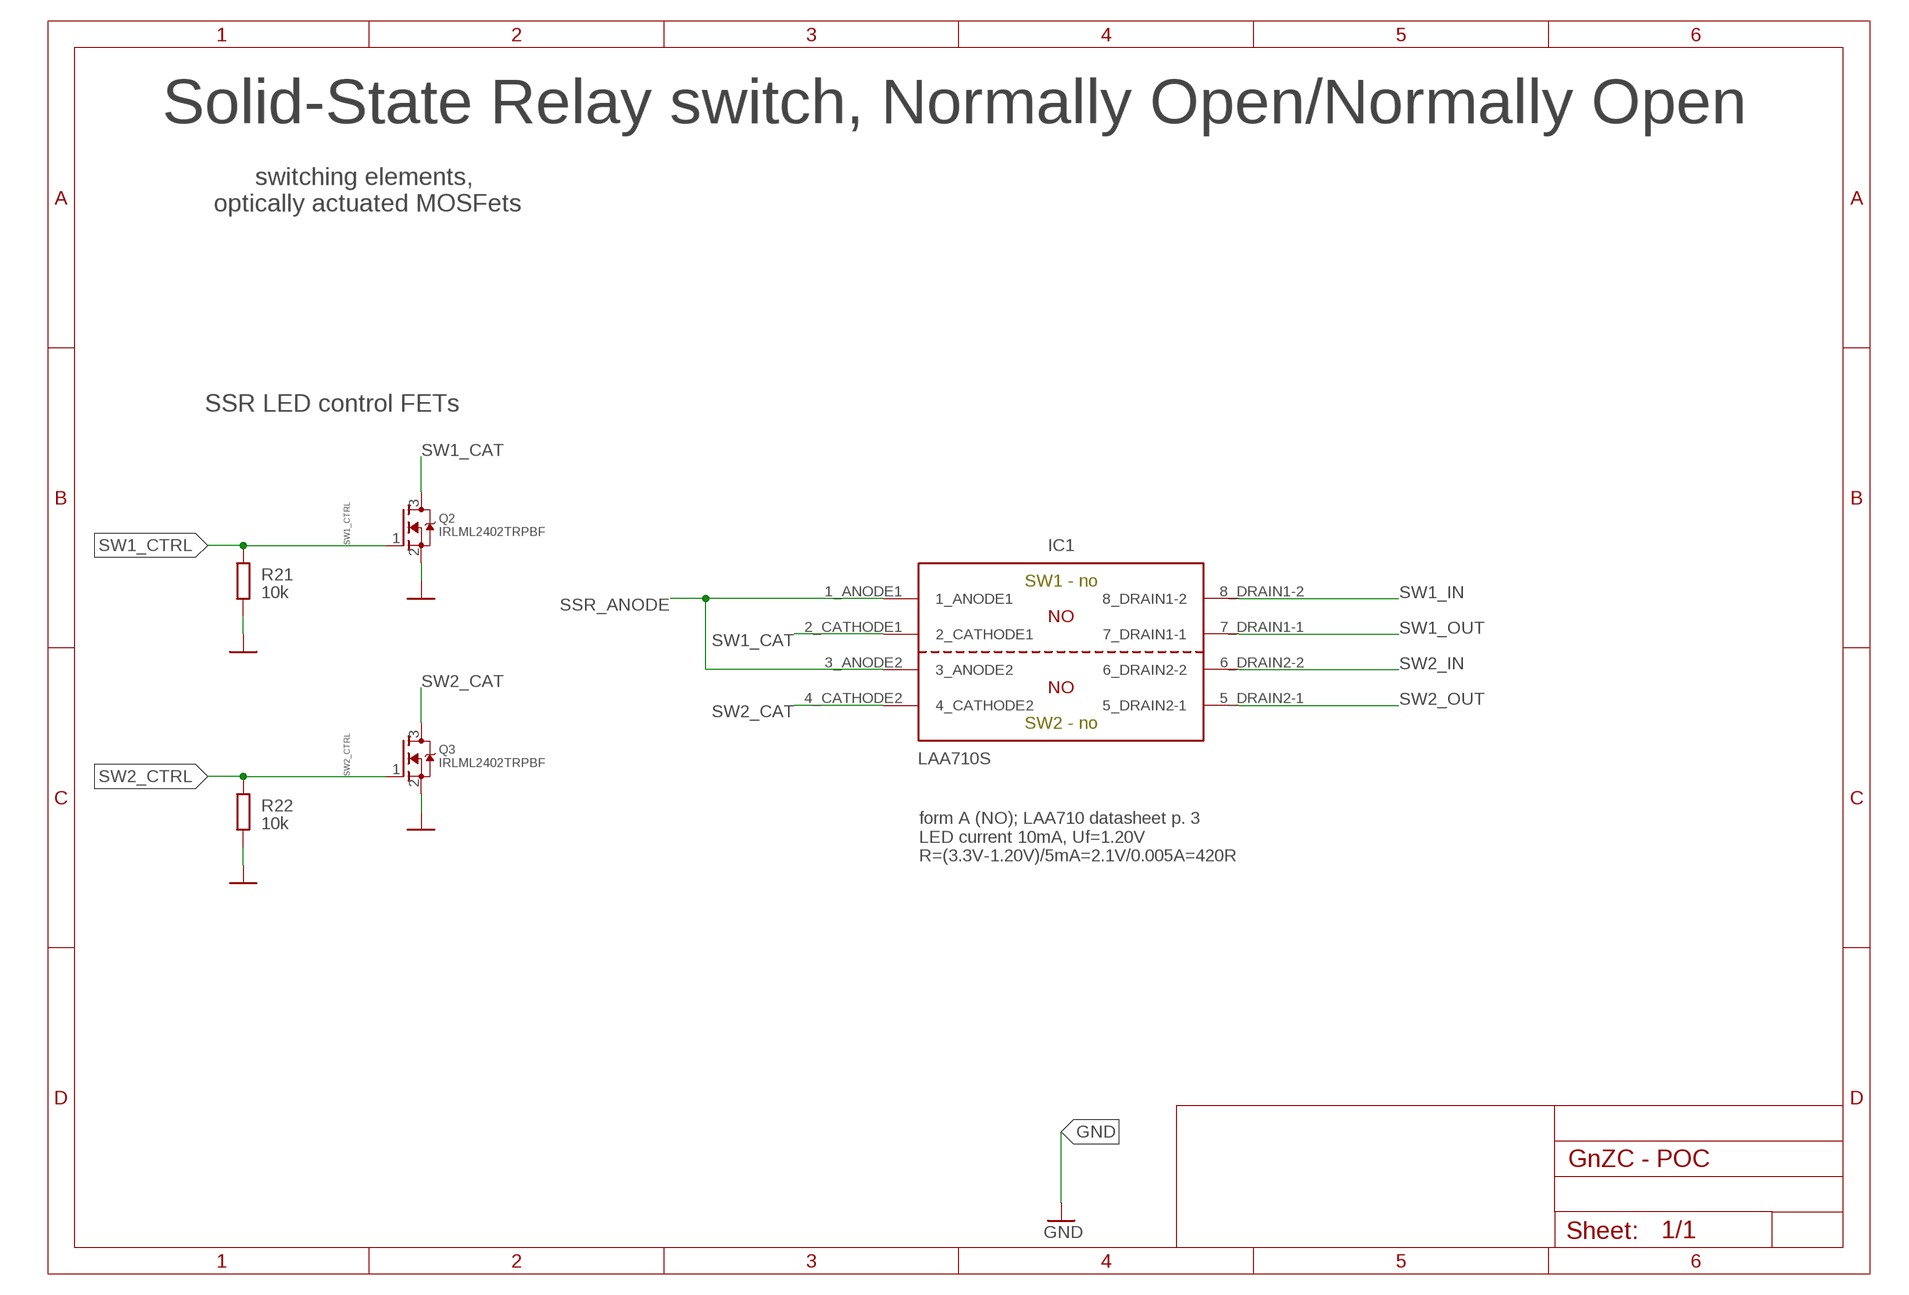
[diagram p7: schematic, module SSR_NO/NO, sheet 1]

### Parts
IC1  LAA710S  LAA710  [SMD_DIP8]
Q2  IRLML2402TRPBF  MOSFET-NREFLOW  [SOT23]
Q3  IRLML2402TRPBF  MOSFET-NREFLOW  [SOT23]
R21  10k  R-EU_R0805  [R0805]
R22  10k  R-EU_R0805  [R0805]

### Nets
GND: Q2.2(S) Q3.2(S) R21.2 R22.2
SSR_ANODE: IC1.1_ANODE1 IC1.3_ANODE2
SW1_CAT [signal]: IC1.2_CATHODE1 Q2.3(D)
SW1_CTRL [signal]: Q2.1(G) R21.1
SW1_IN [DYNAMO_OUT]: IC1.8_DRAIN1-2
SW1_OUT [DYNAMO_OUT]: IC1.7_DRAIN1-1
SW2_CAT [signal]: IC1.4_CATHODE2 Q3.3(D)
SW2_CTRL [signal]: Q3.1(G) R22.1
SW2_IN [DYNAMO_OUT]: IC1.6_DRAIN2-2
SW2_OUT [DYNAMO_OUT]: IC1.5_DRAIN2-1

### Notes on the sheet
- Solid-State Relay switch, Normally Open/Normally Open
- switching elements, 
  optically actuated MOSFets
- SSR LED control FETs
- SW1 - no
- SW2 - no
- form A (NO); LAA710 datasheet p. 3
  LED current 10mA, Uf=1.20V
  R=(3.3V-1.20V)/5mA=2.1V/0.005A=420R

### Library data of the parts
IC1 = LxA710 - Solid State Relay Form A-AB:LAA710
Q2 Q3 = adafruit:MOSFET-N: N-Channel Mosfet 2N7002E - 60V 260mA SOT23 [Digikey: 2N7002ET1GOSTR-ND] - REEL BSH103 - 30V 850mA SOT23 [Digikey: 568-5013-1-ND]
R21 R22 = rcl:R-EU_: RESISTOR, European symbol; SPICEPREFIX: R

## Module OVP
Ports: N1(pas) N2(pas)
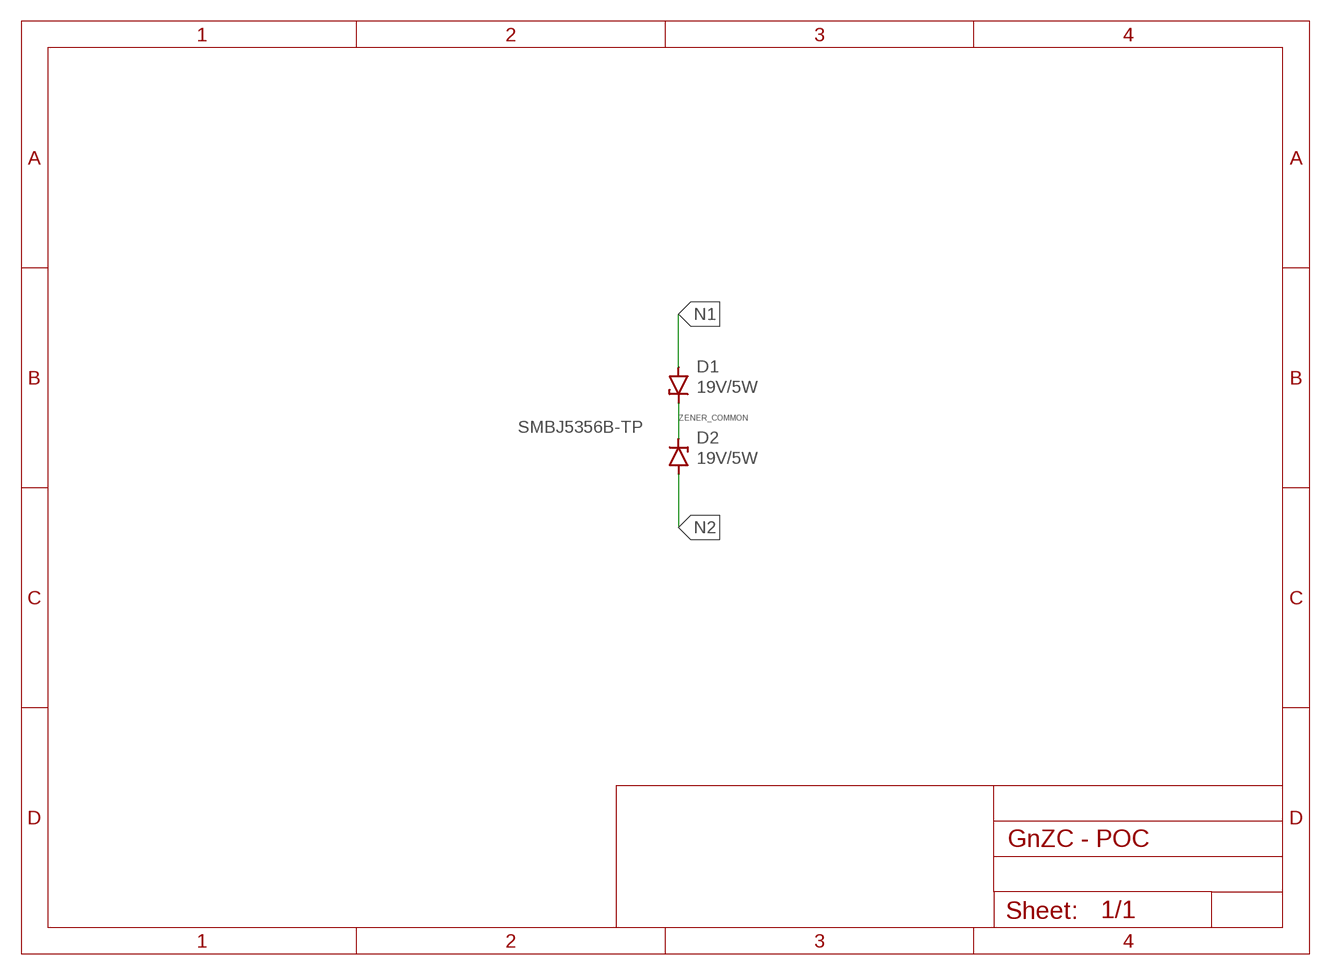
[diagram p8: schematic, module OVP, sheet 1]

### Parts
D1  19V/5W  ZENER-DIODEDO214AA  [DO214AA]
D2  19V/5W  ZENER-DIODEDO214AA  [DO214AA]

### Nets
N1 [DYNAMO_OUT]: D1.A
N2 [DYNAMO_OUT]: D2.A
ZENER_COMMON [DYNAMO_OUT]: D1.C D2.C

### Notes on the sheet
- SMBJ5356B-TP

### Library data of the parts
D1 D2 = diode:ZENER-DIODE: Z-Diode

## Net classes
0 GND: width 0.5 mm, drill 0.3 mm, clearance 0.2 mm
1 DYNAMO_OUT: width 0.5 mm, drill 0.3 mm, clearance 0.2 mm
2 V_DC: width 0.3 mm, drill 0.3 mm, clearance 0.2 mm
3 V_REGULATED: width 0.3 mm, drill 0.3 mm, clearance 0.2 mm
4 Vcc: width 0.3 mm, drill 0.3 mm, clearance 0.2 mm
5 signal: width 0.3 mm, drill 0.3 mm, clearance 0.2 mm